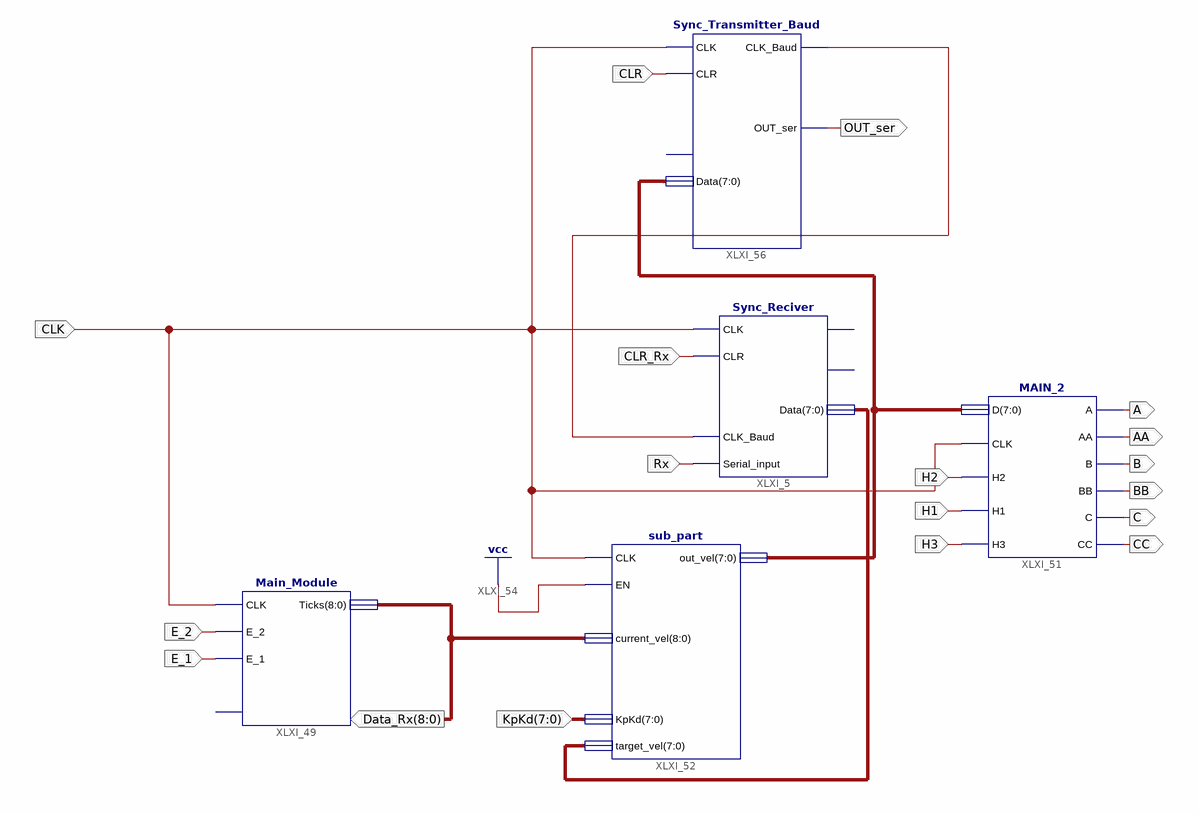
[diagram p0: schematic sheet 1]
// Xilinx ISE schematic Main.sch (spartan6) as structural Verilog: 5 symbols, 18 ports
module Main (
  input  CLR_Rx,
  input  CLK,
  input  Rx,
  input  E_2,
  input  E_1,
  input  H2,
  input  H1,
  input  H3,
  input  [7:0] KpKd,
  input  CLR,
  output CC,
  output C,
  output BB,
  output B,
  output AA,
  output A,
  output [8:0] Data_Rx,
  output OUT_ser
);

  wire XLXN_76;
  wire [7:0] XLXN_85, XLXN_86;

  Sync_Reciver XLXI_5 (
    .CLK(CLK), .CLR(CLR_Rx), .CLK_Baud(XLXN_76), .Serial_input(Rx), .Data(XLXN_86));  // open: Data_Ready, Parity_ERR
  Main_Module XLXI_49 (.CLK(CLK), .E_2(E_2), .E_1(E_1), .Ticks(Data_Rx));  // open: RST_1
  MAIN_2 XLXI_51 (.D(XLXN_85), .CLK(CLK), .H2(H2), .H1(H1), .H3(H3), .A(A), .AA(AA), .B(B), .BB(BB), .C(C), .CC(CC));
  sub_part XLXI_52 (.CLK(CLK), .EN(1'b1), .current_vel(Data_Rx), .KpKd(KpKd), .target_vel(XLXN_86), .out_vel(XLXN_85));
  Sync_Transmitter_Baud XLXI_56 (
    .CLK(CLK), .CLR(CLR), .CLK_Baud(XLXN_76), .OUT_ser(OUT_ser), .Data(XLXN_85));  // open: RST
endmodule
